# EAGLE design usbasp_plus_target (EAGLE 7.2.0)
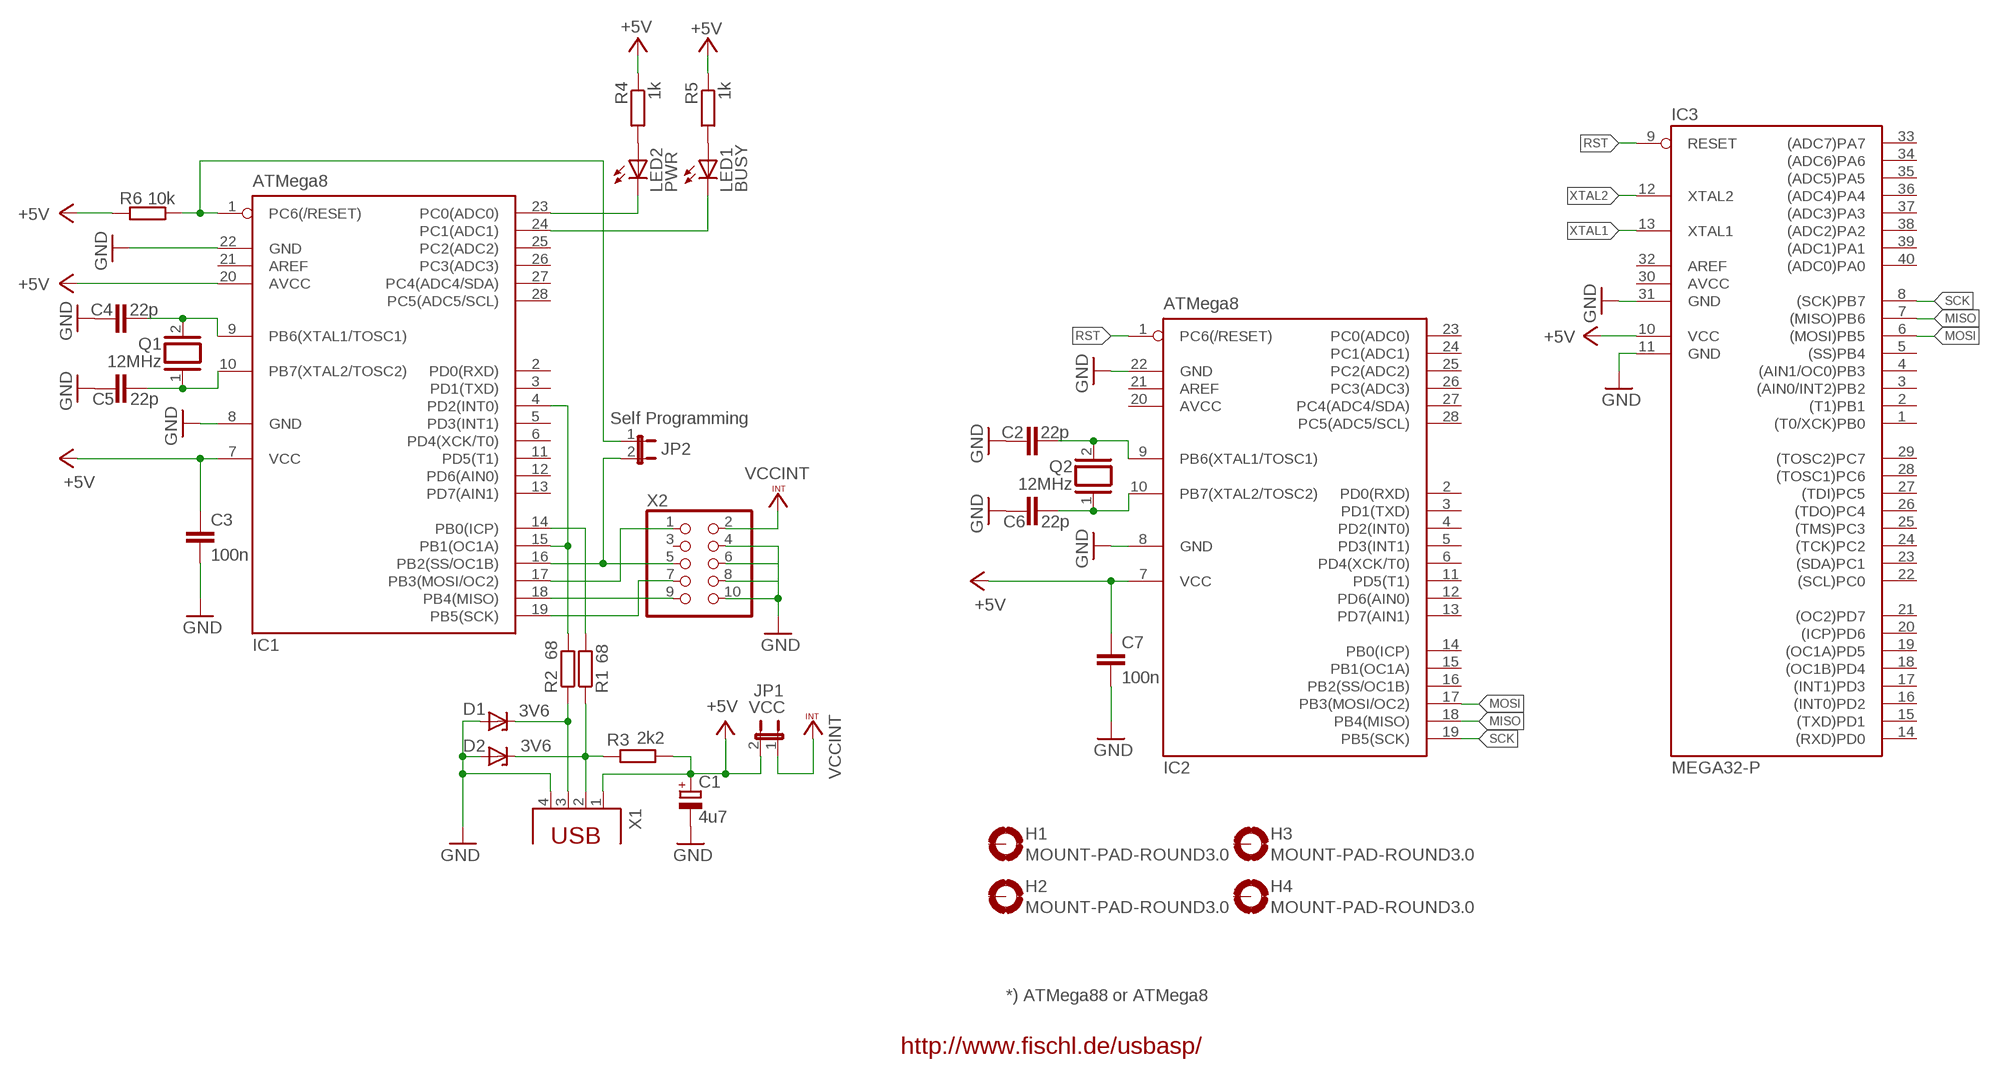
[diagram p0: schematic, sheet 1]

## Parts
C1  4u7  CPOL-EUE2.5-5  [E2,5-5]
C2  22p  C-EU025-024X044  [C025-024X044]
C3  100n  C-EU025-024X044  [C025-024X044]
C4  22p  C-EU025-024X044  [C025-024X044]
C5  22p  C-EU025-024X044  [C025-024X044]
C6  22p  C-EU025-024X044  [C025-024X044]
C7  100n  C-EU025-024X044  [C025-024X044]
D1  3V6  ZENER-DIODEDO34-7  [DO34Z7]
D2  3V6  ZENER-DIODEDO34-7  [DO34Z7]
H1  MOUNT-PAD-ROUND3.0  [3,0-PAD]
H2  MOUNT-PAD-ROUND3.0  [3,0-PAD]
H3  MOUNT-PAD-ROUND3.0  [3,0-PAD]
H4  MOUNT-PAD-ROUND3.0  [3,0-PAD]
IC1  ATMega8  MEGA8-P  [DIL28-3]
IC2  ATMega8  MEGA8-P  [DIL28-3]
IC3  MEGA32-P  [DIL40]
JP1  VCC  JP1E  [JP1]
JP2  Self Programming  JP1E  [JP1]
LED1  BUSY  LED3MM  [LED3MM]
LED2  PWR  LED3MM  [LED3MM]
Q1  12MHz  XTAL/S  [QS]
Q2  12MHz  XTAL/S  [QS]
R1  68  R-EU_0204_7  [0204_7]
R2  68  R-EU_0204_7  [0204_7]
R3  2k2  R-EU_0204_7  [0204_7]
R4  1k  R-EU_0204_7  [0204_7]
R5  1k  R-EU_0204_7  [0204_7]
R6  10k  R-EU_0204_7  [0204_7]
X1  PN61729  [PN61729]
X2  PINHD-2X5  [2X05]

## Nets
+5V: C1.+ C3.1 C7.1 IC1.7(VCC) IC1.20(AVCC) IC2.7(VCC) IC3.10(VCC) JP1.2 R3.1 R4.1 R5.1 R6.1 X1.1
GND: C1.- C2.1 C3.2 C4.1 C5.1 C6.1 C7.2 D1.A D2.A IC1.8(GND) IC1.22(GND) IC2.8(GND) IC2.22(GND) IC3.11(GND) IC3.31(GND) X1.4 X2.4 X2.6 X2.8 X2.10
MISO: IC1.18(PB4(MISO)) IC2.18(PB4(MISO)) IC3.7((MISO)PB6) X2.9
MOSI: IC1.17(PB3(MOSI/OC2)) IC2.17(PB3(MOSI/OC2)) IC3.6((MOSI)PB5) X2.1
N$1: IC1.1(PC6(/RESET)) JP2.1 R6.2
N$5: D2.C R1.1 R3.2 X1.2
N$7: IC1.4(PD2(INT0)) IC1.15(PB1(OC1A)) R2.2
N$8: D1.C R2.1 X1.3
N$13: LED2.A R4.2
N$14: IC1.23(PC0(ADC0)) LED2.K(C)
N$15: IC1.24(PC1(ADC1)) LED1.K(C)
N$16: IC1.14(PB0(ICP)) R1.2
N$22: C4.2 IC1.9(PB6(XTAL1/TOSC1)) Q1.2
N$23: C5.2 IC1.10(PB7(XTAL2/TOSC2)) Q1.1
N$25: LED1.A R5.2
RST: IC1.16(PB2(SS/OC1B)) IC2.1(PC6(/RESET)) IC3.9(RESET) JP2.2 X2.5
SCK: IC1.19(PB5(SCK)) IC2.19(PB5(SCK)) IC3.8((SCK)PB7) X2.7
VCCINT: JP1.1 X2.2
XTAL1: C2.2 IC2.9(PB6(XTAL1/TOSC1)) IC3.13(XTAL1) Q2.2
XTAL2: C6.2 IC2.10(PB7(XTAL2/TOSC2)) IC3.12(XTAL2) Q2.1
Unconnected: H1.B3,0(MOUNT) H2.B3,0(MOUNT) H3.B3,0(MOUNT) H4.B3,0(MOUNT) IC1.2(PD0(RXD)) IC1.3(PD1(TXD)) IC1.5(PD3(INT1)) IC1.6(PD4(XCK/T0)) IC1.11(PD5(T1)) IC1.12(PD6(AIN0)) IC1.13(PD7(AIN1)) IC1.21(AREF) IC1.25(PC2(ADC2)) IC1.26(PC3(ADC3)) IC1.27(PC4(ADC4/SDA)) IC1.28(PC5(ADC5/SCL)) IC2.2(PD0(RXD)) IC2.3(PD1(TXD)) IC2.4(PD2(INT0)) IC2.5(PD3(INT1)) IC2.6(PD4(XCK/T0)) IC2.11(PD5(T1)) IC2.12(PD6(AIN0)) IC2.13(PD7(AIN1)) IC2.14(PB0(ICP)) IC2.15(PB1(OC1A)) IC2.16(PB2(SS/OC1B)) IC2.21(AREF) IC2.23(PC0(ADC0)) IC2.24(PC1(ADC1)) IC2.25(PC2(ADC2)) IC2.26(PC3(ADC3)) IC2.27(PC4(ADC4/SDA)) IC2.28(PC5(ADC5/SCL)) IC3.1((T0/XCK)PB0) IC3.2((T1)PB1) IC3.3((AIN0/INT2)PB2) IC3.4((AIN1/OC0)PB3) IC3.5((SS)PB4) IC3.14((RXD)PD0) IC3.15((TXD)PD1) IC3.16((INT0)PD2) IC3.17((INT1)PD3) IC3.18((OC1B)PD4) IC3.19((OC1A)PD5) IC3.20((ICP)PD6) IC3.21((OC2)PD7) IC3.22((SCL)PC0) IC3.23((SDA)PC1) IC3.24((TCK)PC2) IC3.25((TMS)PC3) IC3.26((TDO)PC4) IC3.27((TDI)PC5) IC3.28((TOSC1)PC6) IC3.29((TOSC2)PC7) IC3.32(AREF) IC3.33((ADC7)PA7) IC3.34((ADC6)PA6) IC3.35((ADC5)PA5) IC3.36((ADC4)PA4) IC3.37((ADC3)PA3) IC3.38((ADC2)PA2) IC3.39((ADC1)PA1) IC3.40((ADC0)PA0) X2.3

## Notes on the sheet
- *) ATMega88 or ATMega8
- http://www.fischl.de/usbasp/

## Power pins joined to a net without a drawn wire
AVCC: IC2.20(AVCC) IC3.30(AVCC)

## Library data of the parts
C1 = rcl:CPOL-EU: POLARIZED CAPACITOR, European symbol
C2-C7 = Bona:C-EU: CAPACITOR, European symbol
D1 D2 = diode:ZENER-DIODE: Z-Diode
H1-H4 = holes:MOUNT-PAD-ROUND: MOUNTING PAD, round
IC1 IC2 = atmel:MEGA8-P: MICROCONTROLLER 8 Kbytes FLASH, 1 kbytes SRAM, 512 bytes EEPROM, USART, 4-channel 10 bit ADC, 2-channel 8 bit ADC Pin compatible with Atmega48, ATMega88, ATMega168 Source: avr.lbr; OC_FARNELL: unknown; OC_NEWARK: unknown
IC3 = atmel:MEGA32-P: MICROCONTROLLER 32 Kbytes FLASH 2 Kbytes SRAM 1 Kbytes EEPROM USART 8-channel 10 bit ADC Source: www.atmel.com .. doc2503.pdf; MPN: ATMEGA32-16PU; OC_FARNELL: 1661729; OC_NEWARK: 51P1794
JP1 JP2 = jumper:JP1E: JUMPER
LED1 LED2 = led:LED: LED OSRAM: - CHIPLED LG R971, LG N971, LY N971, LG Q971, LY Q971, LO R971, LY R971 LH N974, LH R974 LS Q976, LO Q976, LY Q976 LO Q996 - Hyper CHIPLED LW Q18S LB Q993, LB Q99A, LB R99A - SideLED LS A670, LO A670, LY A670, LG A670, LP A670 LB A673, LV A673, LT A673, LW A673 LH A674 LY A675 LS A676, LA A676, LO A676, LY A676, LW A676 LS A679, LY A679, LG A679 - Hyper Micro SIDELED® LS Y876, LA Y876, LO Y876, LY Y876 LT Y87S - SmartLED LW L88C, LW L88S LB L89C, LB L89S, LG L890 LS L89K, LO L89K, LY L89K LS L896, LA L896, LO L896, LY L896 - TOPLED LS T670, LO T670, LY T670, LG T670, LP T670 LSG T670, LSP T670, LSY T670, LOP T670, LYG T670 LG T671, LOG T671, LSG T671 LB T673, LV T673, LT T673, LW T673 LH T674 LS T676, LA T676, LO T676, LY T676, LB T676, LH T676, LSB T676, LW T676 LB T67C, LV T67C, LT T67C, LS T67K, LO T67K, LY T67K, LW E67C LS E67B, LA E67B, LO E67B, LY E67B, LB E67C, LV E67C, LT E67C LW T67C LS T679, LY T679, LG T679 LS T770, LO T770, LY T770, LG T770, LP T770 LB T773, LV T773, LT T773, LW T773 LH T774 LS E675, LA E675, LY E675, LS T675 LS T776, LA T776, LO T776, LY T776, LB T776 LHGB T686 LT T68C, LB T68C - Hyper Mini TOPLED® LB M676 - Mini TOPLED Santana® LG M470 LS M47K, LO M47K, LY M47K Source: http://www.osram.convergy.de LUXEON: - LUMILED® LXK2-PW12-R00, LXK2-PW12-S00, LXK2-PW14-U00, LXK2-PW14-V00 LXK2-PM12-R00, LXK2-PM12-S00, LXK2-PM14-U00 LXK2-PE12-Q00, LXK2-PE12-R00, LXK2-PE12-S00, LXK2-PE14-T00, LXK2-PE14-U00 LXK2-PB12-K00, LXK2-PB12-L00, LXK2-PB12-M00, LXK2-PB14-N00, LXK2-PB14-P00, LXK2-PB14-Q00 LXK2-PR12-L00, LXK2-PR12-M00, LXK2-PR14-Q00, LXK2-PR14-R00 LXK2-PD12-Q00, LXK2-PD12-R00, LXK2-PD12-S00 LXK2-PH12-R00, LXK2-PH12-S00 LXK2-PL12-P00, LXK2-PL12-Q00, LXK2-PL12-R00 Source: www.luxeon.com KINGBRIGHT: KA-3528ASYC Source: www.kingbright.com
Q1 Q2 = special:XTAL/S: CRYSTAL
R1-R6 = Bona:R-EU_: RESISTOR, European symbol
X1 = con-berg:PN61729: BERG USB connector; OC_FARNELL: unknown; OC_NEWARK: unknown
X2 = pinhead:PINHD-2X5: PIN HEADER

## Board
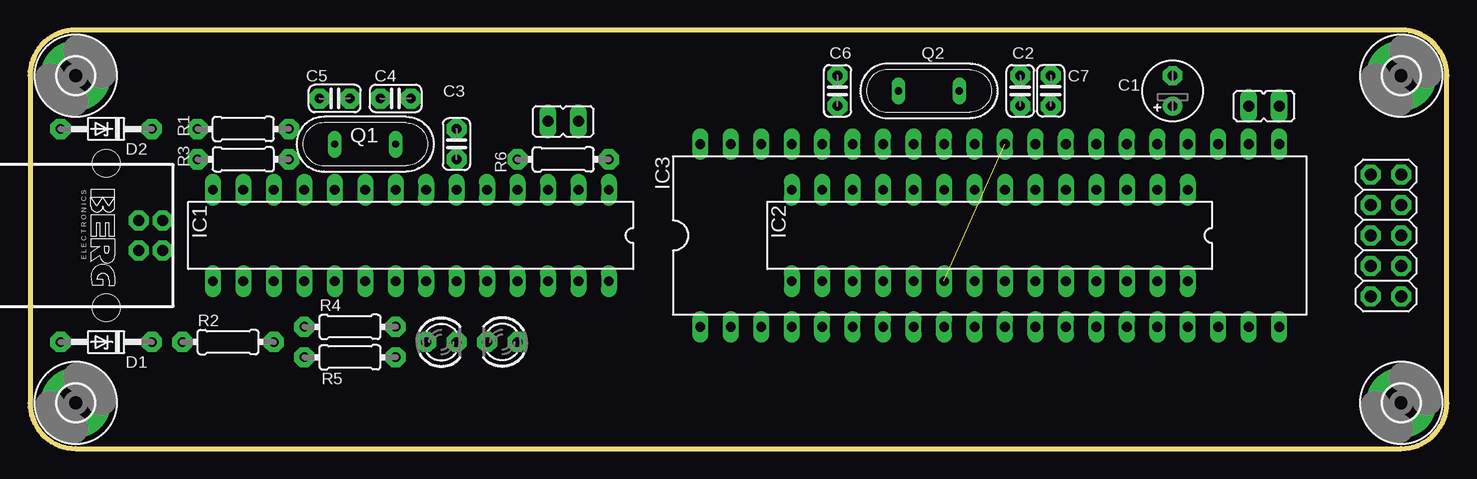
[diagram p1: board, top side]
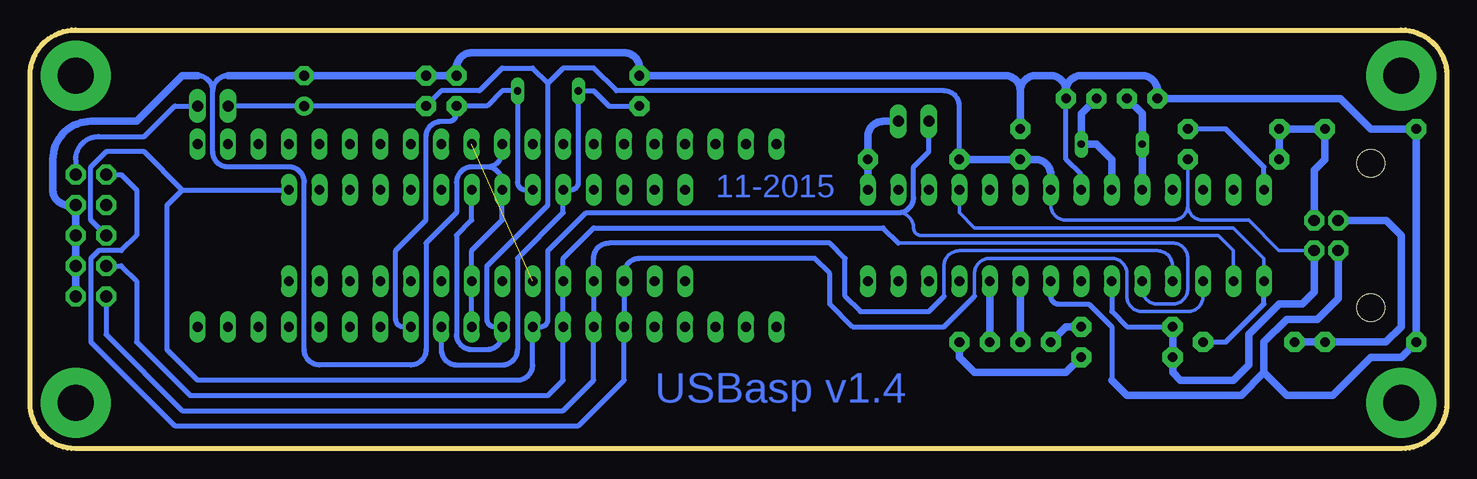
[diagram p2: board, bottom side, seen from below]

Size 118.11 x 34.92 mm. Coordinates in mm from the lower left corner, seen from the top.
Outline: 3.81,0 114.3,0 arc90 118.11,3.81 118.11,31.11 arc90 114.3,34.92 3.81,34.92 arc90 0,31.11 0,3.81 arc90 3.81,0
Copper layers (1*16): Top 0.035mm / dielectric 1.5mm / Bottom 0.035mm
Design rules "default": minimum track width 10mil, minimum drill 24mil, track to track 8mil, track to pad 8mil, pad to pad 8mil, via to via 8mil, smd to smd 8mil, copper to edge 40mil, drill to drill 8mil, minimum pad ring 10mil, minimum via ring 8mil, stop-mask expansion 4mil, vias tented up to drill 0mil, thermal gap 10mil

### Footprints (pad centres in the part's own frame; a part is rotated, then mirrored left to right if it is on the bottom)
E2,5-5 = drill 0.813 pad 1.6: + -1.27,0 | drill 0.813 pad 1.6 octagon: - 1.27,0
C025-024X044 = drill 0.8 pad 1.676 octagon: 1 -1.27,0; 2 1.27,0
DO34Z7 = drill 0.813 pad 1.676 octagon: A 3.81,0; C -3.81,0
3,0-PAD = drill 3 pad 5.842: B3,0 0,0
DIL28-3 = drill 0.813 long: 1 -16.51,-3.81; 2 -13.97,-3.81; 3 -11.43,-3.81; 4 -8.89,-3.81; 5 -6.35,-3.81; 6 -3.81,-3.81; 7 -1.27,-3.81; 8 1.27,-3.81; 9 3.81,-3.81; 10 6.35,-3.81; 11 8.89,-3.81; 12 11.43,-3.81; 13 13.97,-3.81; 14 16.51,-3.81; 15 16.51,3.81; 16 13.97,3.81; 17 11.43,3.81; 18 8.89,3.81; 19 6.35,3.81; 20 3.81,3.81; 21 1.27,3.81; 22 -1.27,3.81; 23 -3.81,3.81; 24 -6.35,3.81; 25 -8.89,3.81; 26 -11.43,3.81; 27 -13.97,3.81; 28 -16.51,3.81
DIL40 = drill 0.813 long: 1 -24.13,-7.62; 2 -21.59,-7.62; 3 -19.05,-7.62; 4 -16.51,-7.62; 5 -13.97,-7.62; 6 -11.43,-7.62; 7 -8.89,-7.62; 8 -6.35,-7.62; 9 -3.81,-7.62; 10 -1.27,-7.62; 11 1.27,-7.62; 12 3.81,-7.62; 13 6.35,-7.62; 14 8.89,-7.62; 15 11.43,-7.62; 16 13.97,-7.62; 17 16.51,-7.62; 18 19.05,-7.62; 19 21.59,-7.62; 20 24.13,-7.62; 21 24.13,7.62; 22 21.59,7.62; 23 19.05,7.62; 24 16.51,7.62; 25 13.97,7.62; 26 11.43,7.62; 27 8.89,7.62; 28 6.35,7.62; 29 3.81,7.62; 30 1.27,7.62; 31 -1.27,7.62; 32 -3.81,7.62; 33 -6.35,7.62; 34 -8.89,7.62; 35 -11.43,7.62; 36 -13.97,7.62; 37 -16.51,7.62; 38 -19.05,7.62; 39 -21.59,7.62; 40 -24.13,7.62
JP1 = drill 0.914 long: 1 0,-1.27; 2 0,1.27
LED3MM = drill 0.813 pad 1.676 octagon: A -1.27,0; K 1.27,0
QS = drill 0.61 long: 1 -2.54,0; 2 2.54,0
0204_7 = drill 0.8 pad 1.676 octagon: 1 -3.81,0; 2 3.81,0
PN61729 = drill 0.95 pad 1.676 octagon: 1 1.25,4.71; 2 -1.25,4.71; 3 -1.25,2.71; 4 1.25,2.71 | hole 2.3: -6.02,0; 6.02,0
2X05 = drill 1.016 pad 1.676 octagon: 1 -5.08,-1.27; 2 -5.08,1.27; 3 -2.54,-1.27; 4 -2.54,1.27; 5 0,-1.27; 6 0,1.27; 7 2.54,-1.27; 8 2.54,1.27; 9 5.08,-1.27; 10 5.08,1.27

### Placement (x,y rotation side)
C1  95.25,29.84 90 top
C2  82.55,29.84 270 top
C3  35.56,25.4 90 top
C4  30.48,29.21 180 top
C5  25.4,29.21 0 top
C6  67.31,29.84 270 top
C7  85.09,29.84 90 top
D1  6.35,8.89 180 top
D2  6.35,26.67 180 top
H1  114.3,3.81 0 top
H2  114.3,31.11 0 top
H3  3.81,31.11 0 top
H4  3.81,3.81 0 top
IC1  31.75,17.78 180 top
IC2  80.01,17.78 180 top
IC3  80.01,17.78 0 top
JP1  102.87,28.57 90 top
JP2  44.45,27.3 90 top
LED1  39.37,8.89 180 top
LED2  34.29,8.89 0 top
Q1  27.94,25.4 0 top
Q2  74.93,29.84 0 top
R1  17.78,26.67 0 top
R2  16.51,8.89 0 top
R3  17.78,24.13 180 top
R4  26.67,10.16 0 top
R5  26.67,7.62 0 top
R6  44.45,24.13 0 top
X1  6.35,17.78 270 top
X2  113.03,17.78 270 top

### Tracks (layer width: path | path; a pad name or v marks a point on that pad's centre or on a via)
+5V
  Bottom 0.305: 21.59,20.32 arc-90 20.32,19.05 16.51,19.05 13.99,16.53 X1.1 | IC1.7 33.02,20.32 arc-90 31.75,19.05 22.86,19.05 arc-90 21.59,20.32 | 21.59,20.32 R3.1
  Bottom 0.406: IC1.20 27.94,11.43 26.67,10.16 R4.1 | IC2.7 81.28,19.05 82.55,17.78 82.55,9.53 arc-90 81.28,8.26 80.01,8.26 arc-90 78.74,9.53 IC3.10 79.38,10.16 arc90 80.01,10.79 80.01,15.24 74.93,20.32 74.93,30.48 | R6.1 40.64,28.57 arc-90 41.91,29.84 69.22,29.84 71.12,31.75 73.66,31.75 74.93,30.48 | JP1.2 C1.+ C7.1 83.82,29.84 80.64,29.84 78.74,31.75 76.2,31.75 74.93,30.48
  Bottom 0.61: R4.1 R5.1 22.86,6.35 22.23,5.71 17.78,5.71 16.51,6.99 16.51,9.53 13.97,12.06 12.06,12.06 11.06,13.07 X1.1 | IC1.7 33.02,22.86 arc-90 34.29,24.13 C3.1 R6.1
AVCC  (1 unrouted)
GND
  Bottom 0.406: IC1.8 30.48,22.86 31.75,24.13 C4.1 | IC1.22 33.02,12.7 arc-90 32.38,12.06 29.84,12.06 27.94,10.16 27.94,5.71 | IC3.11 IC2.22 81.28,16.51 78.74,19.05 IC2.8 78.74,22.23 arc-90 80.01,23.5 | 80.01,23.5 81.28,23.5 arc-90 82.55,22.23 82.55,19.68 85.09,17.14 85.09,8.26 arc90 86.36,6.99 93.98,6.99 arc90 95.25,8.26 95.25,22.23 arc-90 96.52,23.5 101.6,23.5 arc90 102.87,24.77 102.87,29.84 | 102.87,29.84 arc-90 104.14,31.11 | 101.6,31.11 arc-90 102.87,29.84 | IC3.31 78.74,24.77 arc90 80.01,23.5
  Bottom 0.61: C4.1 31.75,29.84 | 31.75,29.84 arc90 30.48,31.11 25.4,31.11 arc90 24.13,29.84 C5.1 8.89,29.21 6.35,26.67 D2.A D1.A 3.81,7.62 6.35,7.62 9.53,4.45 13.34,4.45 15.24,6.35 | C3.2 35.56,29.84 | 35.56,29.84 arc90 34.29,31.11 33.02,31.11 arc90 31.75,29.84 | X2.10 X2.8 X2.6 X2.4 114.94,20.32 arc90 116.2,21.59 116.2,24.13 arc90 113.03,27.3 109.22,27.3 105.41,31.11 104.14,31.11 | 27.94,5.71 26.67,4.45 17.14,4.45 15.24,6.35 | X1.4 9.06,12.53 10.79,10.79 13.34,10.79 15.24,8.89 15.24,6.35 | 35.56,29.84 arc-90 36.83,31.11 C6.1 67.31,31.75 arc-90 68.58,33.02 81.28,33.02 arc-90 82.55,31.75 C2.1 C7.2 C1.- 101.6,31.11
MISO
  Bottom 0.305: 41.91,12.7 41.91,15.24 arc90 40.64,16.51 24.13,16.51 arc90 22.86,15.24 IC1.18
  Bottom 0.406: X2.9 111.76,9.53 105.41,3.17 73.66,3.17 71.12,5.71 IC3.7 IC2.18 71.12,15.88 arc90 69.85,17.14 51.44,17.14 50.16,15.88 50.16,12.7 48.9,11.43 43.18,11.43 41.91,12.7
MOSI
  Bottom 0.305: 39.37,12.7 39.37,14.61 arc90 38.1,15.88 27.94,15.88 arc90 26.67,14.61 26.67,12.7 arc-90 25.4,11.43 21.59,11.43 arc-90 20.32,12.7 IC1.17
  Bottom 0.406: X2.1 110.49,22.86 109.22,21.59 109.22,17.78 110.49,16.51 112.39,16.51 113.03,15.88 113.03,8.89 106.05,1.91 72.39,1.91 68.58,5.71 IC3.6 IC2.17 68.58,14.61 arc90 67.31,15.88 52.7,15.88 51.44,14.61 51.44,12.06 49.53,10.16 41.91,10.16 39.37,12.7
N$1
  Bottom 0.61: IC1.1 R6.2 48.26,26.04 arc90 46.99,27.3 JP2.1
N$5
  Bottom 0.61: X1.2 11.06,23.23 10.16,24.13 D2.C R1.1 R3.2
N$7
  Bottom 0.305: IC1.4 40.64,19.68 39.37,18.41 17.78,18.41 15.24,15.88 IC1.15
  Bottom 0.406: R2.2 18.41,8.89 15.24,12.06 IC1.15
N$8
  Bottom 0.61: R2.1 D1.C 5.08,8.89 3.81,10.16 3.81,17.78 5.06,19.03 X1.3
N$13
  Bottom 0.61: R4.2 31.75,10.16 LED2.A
N$14
  Bottom 0.61: IC1.23 LED2.K
N$15
  Bottom 0.61: IC1.24 LED1.K
N$16
  Bottom 0.406: IC1.14 15.24,23.5 18.41,26.67 R1.2
N$22
  Bottom 0.61: IC1.9 27.94,24.13 29.21,25.4 Q1.2 30.48,27.94 C4.2
N$23
  Bottom 0.61: IC1.10 Q1.1 25.4,27.94 C5.2
N$25
  Bottom 0.61: LED1.A 40.64,7.62 39.37,6.35 31.75,6.35 R5.2
RST
  Bottom 0.305: IC1.16 17.78,16.51 19.05,17.78 43.81,17.78 arc90 44.45,18.41 arc-90 45.72,19.68
  Bottom 0.406: X2.5 113.03,19.05 113.03,23.5 111.76,24.77 108.58,24.77 105.41,21.59 | 105.41,21.59 IC2.1 | 105.41,21.59 106.68,20.32 106.68,8.26 104.14,5.71 77.47,5.71 arc-90 76.2,6.99 IC3.9 75.56,10.16 arc-90 74.93,10.79 74.93,16.51 71.75,19.68 45.72,19.68 arc-90 44.45,20.95 44.45,23.5 43.18,24.77 JP2.2
SCK
  Bottom 0.305: IC1.19 25.4,13.34 arc-90 24.13,12.06 22.86,12.06 arc-90 21.59,13.34 21.59,15.88 arc-90 22.86,17.14 45.72,17.14
  Bottom 0.406: X2.7 110.49,15.24 109.22,13.97 109.22,8.89 104.78,4.45 74.93,4.45 73.66,5.71 IC3.8 IC2.19 73.66,15.88 71.12,18.41 46.99,18.41 45.72,17.14
VCCINT
  Bottom 0.406: X2.2 114.3,24.13 arc90 112.39,26.04 108.58,26.04 106.05,28.57 JP1.1
XTAL1
  Bottom 0.406: IC2.9 76.83,21.59 arc90 77.47,22.23 Q2.2 78.74,29.84 80.01,28.57 C2.2 82.55,27.94 arc90 83.19,27.3 83.82,27.3 arc-90 85.09,26.04 85.09,19.05 87.63,16.51 87.63,10.79 arc-90 87,10.16 IC3.13
XTAL2
  Bottom 0.406: IC3.12 83.82,8.26 arc-90 82.55,6.99 78.74,6.99 arc-90 77.47,8.26 77.47,15.88 73.66,19.68 IC2.10 73.03,21.59 arc-90 72.39,22.23 Q2.1 71.12,29.84 69.85,28.57 C6.2

### Text on the board
Bottom: 11-2015 | USBasp v1.4
tValues: VCC / Target | Self / Programming | MOSI | VCC | N/C | RST | GND | SCK | MISO | GND | USBasp v1.4